# Altium schematic sheet Connectors.SchDoc
size 420 x 297 mm; DocumentNumber: АЕСН.466369.100Э3; SheetNumber: 2; SheetTotal: x; DocumentName: Sheet1.SCHDOC
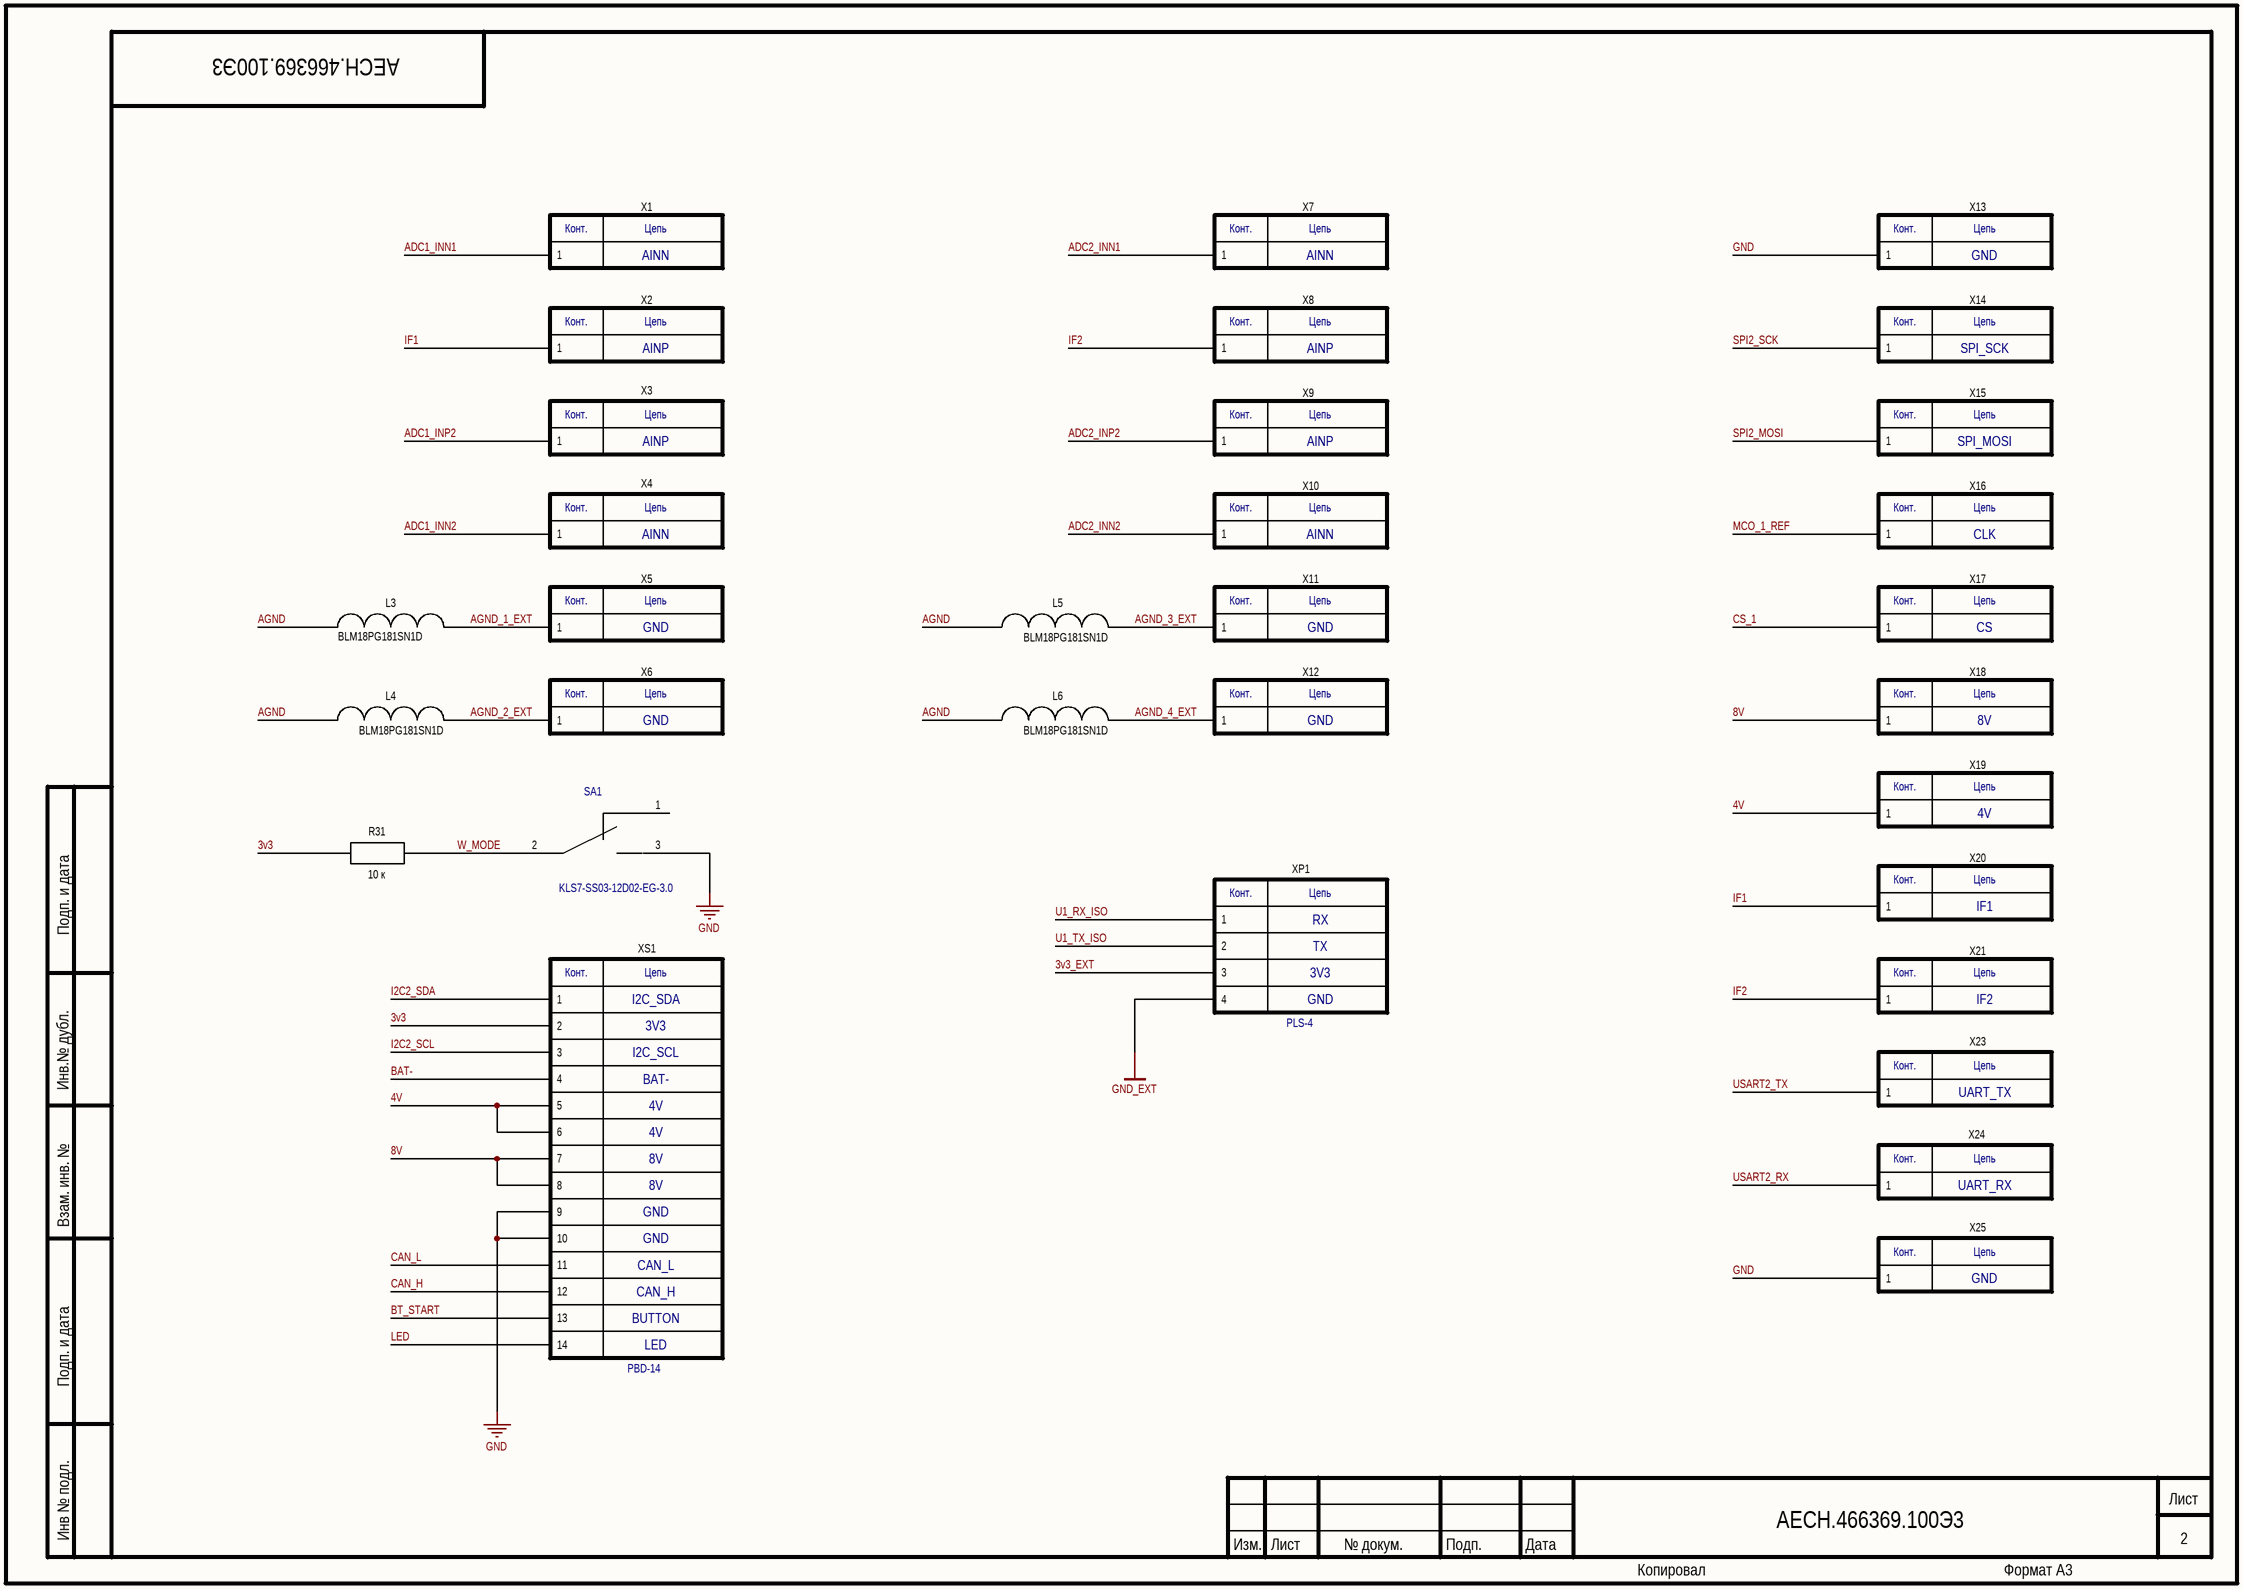
[diagram p0: Connectors.SchDoc]

## Parts
L3  BLM18PG181SN1D  [INDC_0603]
L4  BLM18PG181SN1D  [INDC_0603]
L5  BLM18PG181SN1D  [INDC_0603]
L6  BLM18PG181SN1D  [INDC_0603]
R31  value 10 к  [R0603]  (hidden comment: R)
SA1  PartNumber: KLS7-SS03-12D02-EG-3.0  [KLS7-SS03-12D02]  (hidden comment: Switch)
X1  1pin  [lam 4x2]  (value not drawn)
X2  1pin  [lam 4x2]  (value not drawn)
X3  1pin  [lam 4x2]  (value not drawn)
X4  1pin  [lam 4x2]  (value not drawn)
X5  1pin  [lam 4x2]  (value not drawn)
X6  1pin  [lam 4x2]  (value not drawn)
X7  1pin  [lam 4x2]  (value not drawn)
X8  1pin  [lam 4x2]  (value not drawn)
X9  1pin  [lam 4x2]  (value not drawn)
X10  1pin  [lam 4x2]  (value not drawn)
X11  1pin  [lam 4x2]  (value not drawn)
X12  1pin  [lam 4x2]  (value not drawn)
X13  1pin  [lam 4x2]  (value not drawn)
X14  1pin  [lam 4x2]  (value not drawn)
X15  1pin  [lam 4x2]  (value not drawn)
X16  1pin  [lam 4x2]  (value not drawn)
X17  1pin  [lam 4x2]  (value not drawn)
X18  1pin  [lam 4x2]  (value not drawn)
X19  1pin  [lam 4x2]  (value not drawn)
X20  1pin  [lam 4x2]  (value not drawn)
X21  1pin  [lam 4x2]  (value not drawn)
X23  1pin  [lam 4x2]  (value not drawn)
X24  1pin  [lam 4x2]  (value not drawn)
X25  1pin  [lam 4x2]  (value not drawn)
XP1  4pin  [PLS-4]  (value not drawn)
XS1  14pin  [PBD-14]  (value not drawn)

## Nets
GND: SA1.3 X13.1 X25.1 XS1.9 XS1.10
GND_EXT: XP1.4
3v3: R31.1 XS1.2
3v3_EXT: XP1.3
4V: X19.1 XS1.5 XS1.6
8V: X18.1 XS1.7 XS1.8
ADC1_INN1: X1.1
ADC1_INN2: X4.1
ADC1_INP2: X3.1
ADC2_INN1: X7.1
ADC2_INN2: X10.1
ADC2_INP2: X9.1
AGND: L3.2 L4.2 L5.2 L6.2
AGND_1_EXT: L3.1 X5.1
AGND_2_EXT: L4.1 X6.1
AGND_3_EXT: L5.1 X11.1
AGND_4_EXT: L6.1 X12.1
BAT-: XS1.4
BT_START: XS1.13
CAN_H: XS1.12
CAN_L: XS1.11
CS_1: X17.1
I2C2_SCL: XS1.3
I2C2_SDA: XS1.1
IF1: X2.1 X20.1
IF2: X8.1 X21.1
LED: XS1.14
MCO_1_REF: X16.1
SPI2_MOSI: X15.1
SPI2_SCK: X14.1
U1_RX_ISO: XP1.1
U1_TX_ISO: XP1.2
USART2_RX: X24.1
USART2_TX: X23.1
W_MODE: R31.2 SA1.2

Not connected (* = marked no-connect by the designer): SA1 1

## Notes on the sheet
- AINN
- GND
- AINP
- SPI_SCK
- SPI_MOSI
- CLK
- CS
- 8V
- 4V
- RX
- IF1
- I2C_SDA
- TX
- 3V3
- IF2
- I2C_SCL
- BAT-
- UART_TX
- UART_RX
- CAN_L
- CAN_H
- BUTTON
- LED
- Подп. и дата
- Инв.№ дубл.
- Взам. инв. №
- Инв № подл.
- Изм.
- Лист
- № докум.
- Подп.
- Дата
- Копировал
- Формат А3
- (in symbol 1pin) Конт.; Цепь
- (in symbol 4pin) Конт.; Цепь
- (in symbol 14pin) Конт.; Цепь

## Library data of the parts
L3-L6 = L_1
R31 = R: PartNumber: RC0603JR-0710KL; Tolerance: ±5%; Power: 0.1 Вт; Case: 0603
SA1 = Switch: Manufacturer: *
X1-X21 X23-X25 = 1pin: Manufacturer: *; PartNumber: *
XP1 = 4pin: Manufacturer: *; PartNumber: PLS-4
XS1 = 14pin: Manufacturer: *; PartNumber: PBD-14